# EAGLE design LM317_regulator (EAGLE 9.6.2)
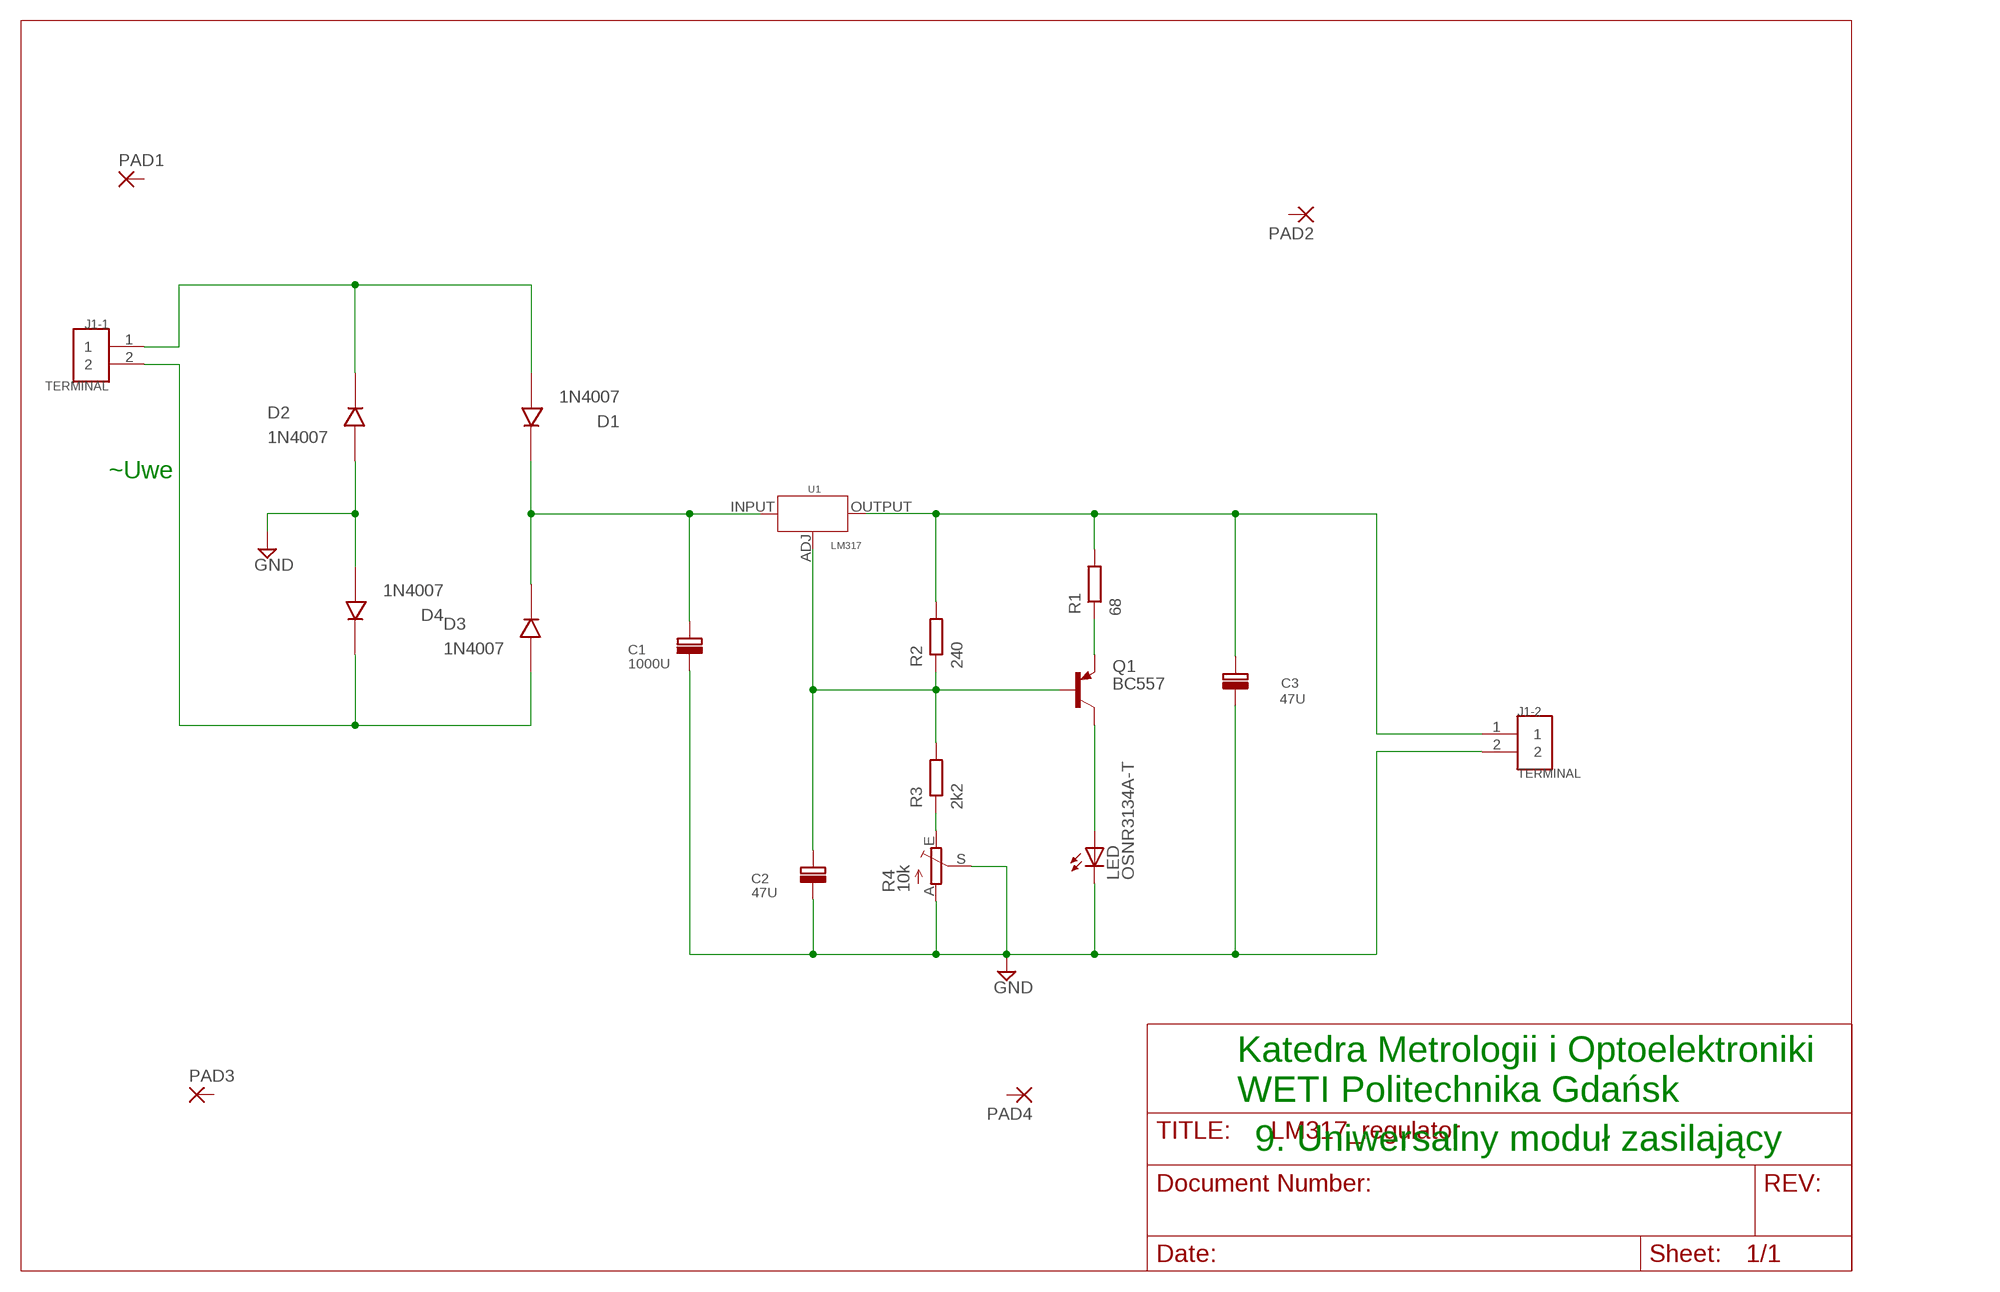
[diagram p0: schematic, sheet 1]

## Parts
C1  1000U  [1000U]
C2  47U  [47U]
C3  47U  [47U]
D1  1N4007  [1N4007]
D2  1N4007  [1N4007]
D3  1N4007  [1N4007]
D4  1N4007  [1N4007]
J1-1  TERMINAL  [TERMINAL]
J1-2  TERMINAL  [TERMINAL]
LED  OSNR3134A-T  LED3MM  [LED3MM]
PAD1  2,54/1,1  [2,54/1,1]
PAD2  2,54/1,1  [2,54/1,1]
PAD3  2,54/1,1  [2,54/1,1]
PAD4  2,54/1,1  [2,54/1,1]
Q1  BC557  [TO92-EBC]
R1  68  1206  [1206]
R2  240  1206  [1206]
R3  2k2  1206  [1206]
R4  10k  TRIM_EU-CA6V  [CA6V]
U1  LM317  [LM317]

## Nets
GND: C1.L C2.L C3.L D2.A(L) D4.A(L) J1-2.2 LED.K(C) R4.A R4.S
N$1: R3.1(H) R4.E
N$2: C1.H D1.C(H) D3.C(H) U1.INPUT(IN)
N$3: D3.A(L) D4.C(H) J1-1.2
N$4: D1.A(L) D2.C(H) J1-1.1
N$5: C2.H Q1.B R2.1(H) R3.2(L) U1.ADJ
N$6: Q1.E R1.1(H)
N$7: C3.H J1-2.1 R1.2(L) R2.2(L) U1.OUTPUT(OUT)
N$8: LED.A Q1.C
Unconnected: PAD1.1(P) PAD2.1(P) PAD3.1(P) PAD4.1(P)

## Notes on the sheet
- ~Uwe
- Katedra Metrologii i Optoelektroniki
  WETI Politechnika Gdańsk
- 9. Uniwersalny moduł zasilający

## Library data of the parts
C1 = Thoene:1000U
C2 C3 = Thoene:47U
D1-D4 = Thoene:1N4007
J1-1 J1-2 = Thoene:TERMINAL
LED = led:LED: LED OSRAM: - CHIPLED LG R971, LG N971, LY N971, LG Q971, LY Q971, LO R971, LY R971 LH N974, LH R974 LS Q976, LO Q976, LY Q976 LO Q996 - Hyper CHIPLED LW Q18S LB Q993, LB Q99A, LB R99A - SideLED LS A670, LO A670, LY A670, LG A670, LP A670 LB A673, LV A673, LT A673, LW A673 LH A674 LY A675 LS A676, LA A676, LO A676, LY A676, LW A676 LS A679, LY A679, LG A679 - Hyper Micro SIDELED® LS Y876, LA Y876, LO Y876, LY Y876 LT Y87S - SmartLED LW L88C, LW L88S LB L89C, LB L89S, LG L890 LS L89K, LO L89K, LY L89K LS L896, LA L896, LO L896, LY L896 - TOPLED LS T670, LO T670, LY T670, LG T670, LP T670 LSG T670, LSP T670, LSY T670, LOP T670, LYG T670 LG T671, LOG T671, LSG T671 LB T673, LV T673, LT T673, LW T673 LH T674 LS T676, LA T676, LO T676, LY T676, LB T676, LH T676, LSB T676, LW T676 LB T67C, LV T67C, LT T67C, LS T67K, LO T67K, LY T67K, LW E67C LS E67B, LA E67B, LO E67B, LY E67B, LB E67C, LV E67C, LT E67C LW T67C LS T679, LY T679, LG T679 LS T770, LO T770, LY T770, LG T770, LP T770 LB T773, LV T773, LT T773, LW T773 LH T774 LS E675, LA E675, LY E675, LS T675 LS T776, LA T776, LO T776, LY T776, LB T776 LHGB T686 LT T68C, LB T68C - Hyper Mini TOPLED® LB M676 - Mini TOPLED Santana® LG M470 LS M47K, LO M47K, LY M47K Source: http://www.osram.convergy.de LUXEON: - LUMILED® LXK2-PW12-R00, LXK2-PW12-S00, LXK2-PW14-U00, LXK2-PW14-V00 LXK2-PM12-R00, LXK2-PM12-S00, LXK2-PM14-U00 LXK2-PE12-Q00, LXK2-PE12-R00, LXK2-PE12-S00, LXK2-PE14-T00, LXK2-PE14-U00 LXK2-PB12-K00, LXK2-PB12-L00, LXK2-PB12-M00, LXK2-PB14-N00, LXK2-PB14-P00, LXK2-PB14-Q00 LXK2-PR12-L00, LXK2-PR12-M00, LXK2-PR14-Q00, LXK2-PR14-R00 LXK2-PD12-Q00, LXK2-PD12-R00, LXK2-PD12-S00 LXK2-PH12-R00, LXK2-PH12-S00 LXK2-PL12-P00, LXK2-PL12-Q00, LXK2-PL12-R00 Source: www.luxeon.com KINGBRIGHT: KA-3528ASYC Source: www.kingbright.com
PAD1-PAD4 = wirepad:2,54/1,1: THROUGH-HOLE PAD
Q1 = transistor-pnp:BC557*: PNP Transistror
R1-R3 = Thoene:1206
R4 = pot:TRIM_EU-: POTENTIOMETER
U1 = Thoene:LM317

## Board
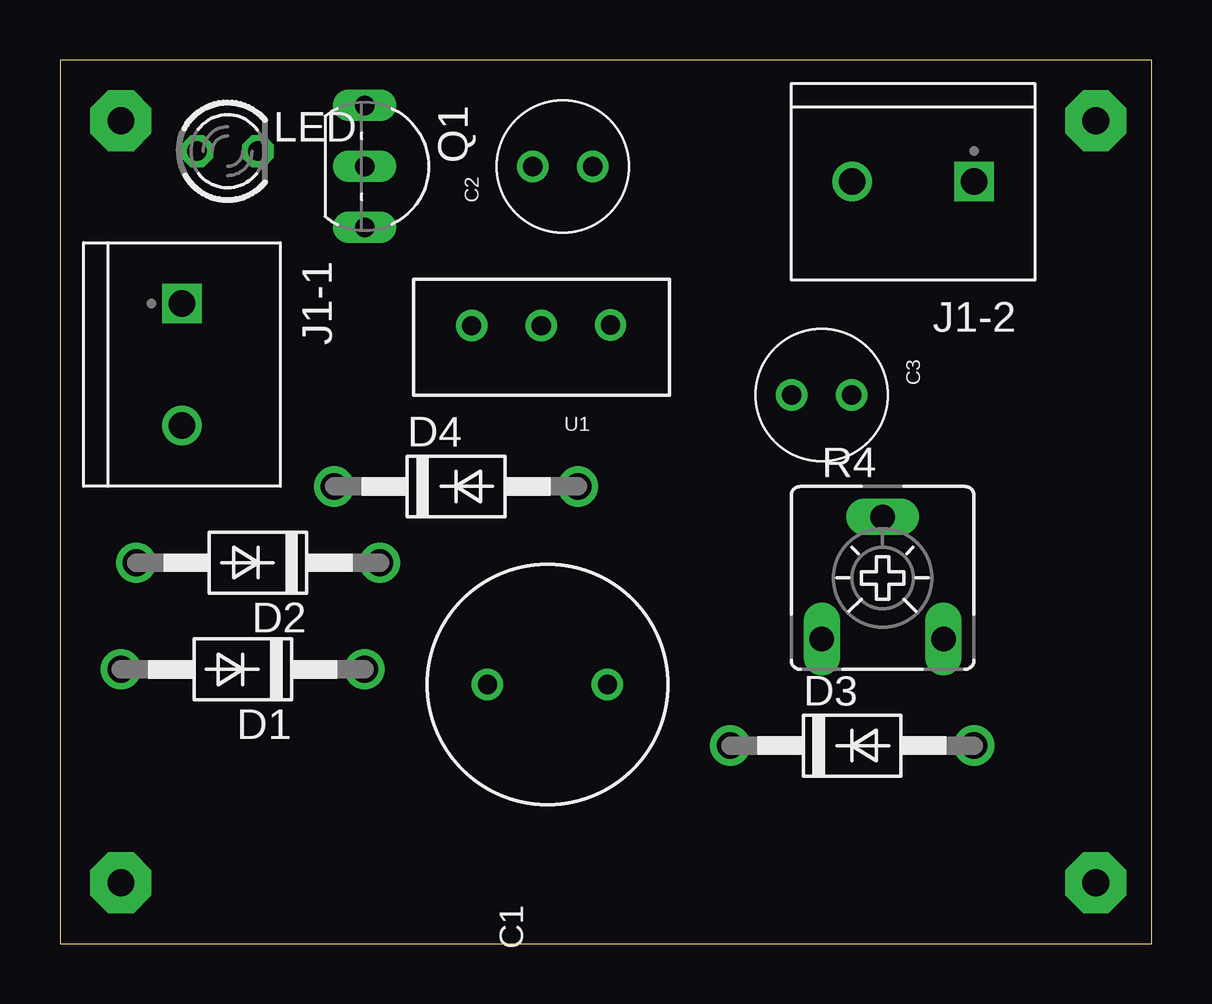
[diagram p1: board, top side]
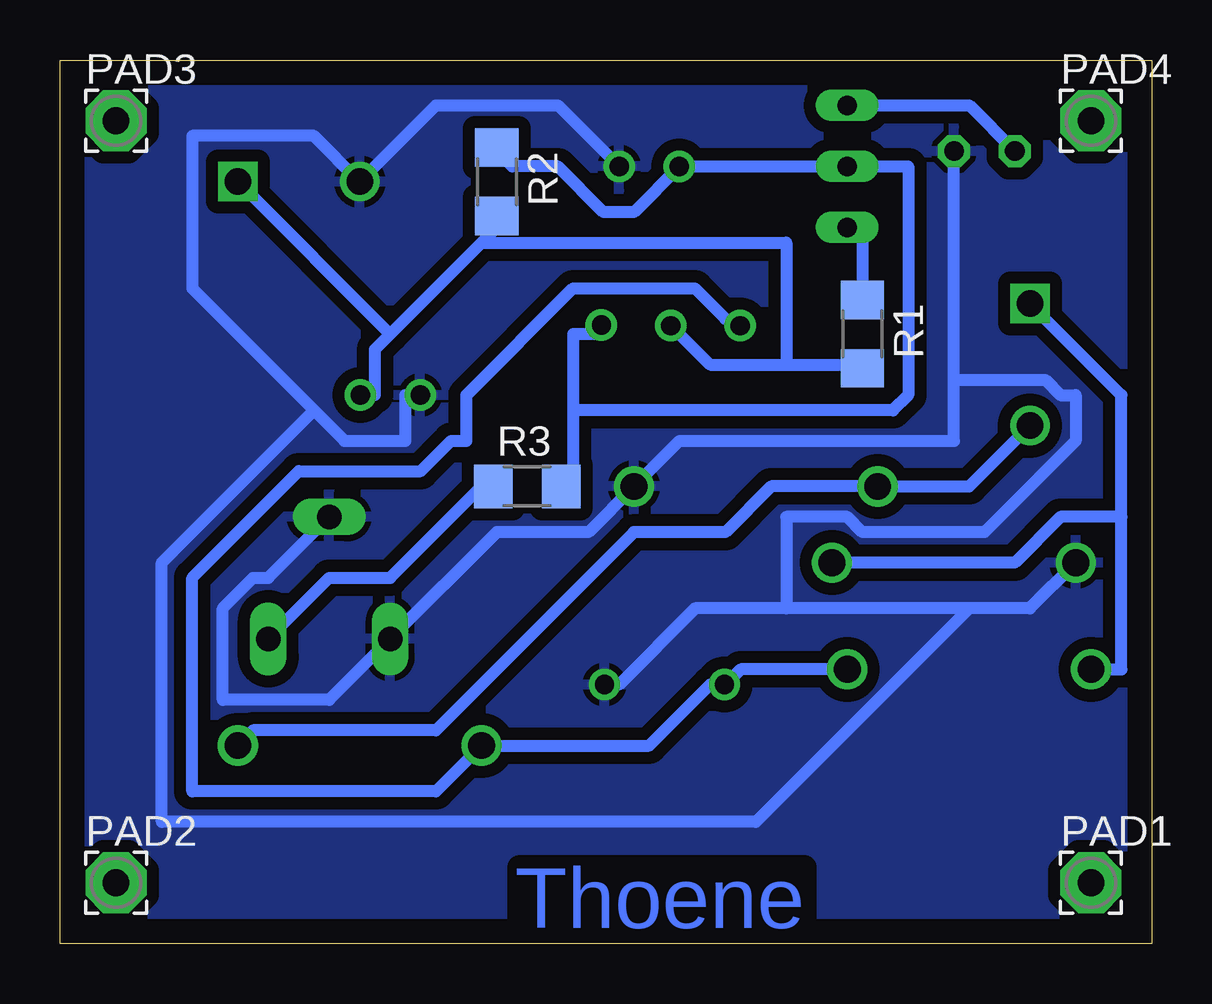
[diagram p2: board, bottom side, seen from below]

Size 45.52 x 36.82 mm. Coordinates in mm from the lower left corner, seen from the top.
Outline: 0,0 45.52,0 45.52,36.82 0,36.82 0,0
Copper layers (1*16): Top 0.035mm / dielectric 1.5mm / Bottom 0.035mm
Design rules "default *": minimum track width 15mil, minimum drill 24mil, track to track 20mil, track to pad 20mil, pad to pad 20mil, via to via 20mil, smd to smd 8mil, copper to edge 40mil, drill to drill 8mil, minimum pad ring 10mil, minimum via ring 8mil, stop-mask expansion 4mil, vias tented up to drill 0mil, thermal gap 10mil

### Footprints (pad centres in the part's own frame; a part is rotated, then mirrored left to right if it is on the bottom)
1000U = drill 0.8: H 0,2.5; L 0,-2.5
47U = drill 0.8: H 0,1.25; L 0,-1.25
1N4007 = drill 1.118: A 5.08,0; C -5.08,0
TERMINAL = drill 1.1 square: 1 -2.54,0 | drill 1.1: 2 2.54,0
LED3MM = drill 0.813 octagon: A -1.27,0; K 1.27,0
2,54/1,1 = drill 1.118 pad 2.54 octagon: 1 0,0
TO92-EBC = drill 0.813 long: B 0,-1.27; C -2.54,-1.27; E 2.54,-1.27
1206 = smd 1.6 x 1.803: 1 -1.422,0; 2 1.422,0
CA6V = drill 1.016 long: A -2.54,-2.54; E 2.54,-2.54; S 0,2.54
LM317 = drill 0.8: ADJ 2.45,-2.92; INPUT 8.24,-2.89; OUTPUT 5.34,-2.89

### Placement (x,y rotation side)
C1  20.32,10.8 90 top
C2  20.95,32.38 90 top
C3  31.75,22.86 270 top
D1  7.62,11.43 180 top
D2  8.26,15.88 180 top
D3  33.02,8.26 0 top
D4  16.51,19.05 0 top
J1-1  5.08,24.13 270 top
J1-2  35.56,31.75 180 top
LED  6.99,33.02 0 top
PAD1  2.54,2.54 0 bottom
PAD2  43.18,2.54 0 bottom
PAD3  43.18,34.29 0 bottom
PAD4  2.54,34.29 0 bottom
Q1  13.97,32.38 270 top
R1  12.06,25.4 270 bottom
R2  27.3,31.75 270 bottom
R3  26.04,19.05 0 bottom
R4  34.29,15.24 0 top
U1  25.4,22.86 180 top

### Tracks (layer width: path | path; a pad name or v marks a point on that pad's centre or on a via)
GND
  Bottom 0.508: 34.92,22.23 40.01,27.3 40.01,33.65 34.92,33.65 J1-2.2 29.84,34.93 24.77,34.93 22.23,32.38 C2.L | 34.92,22.23 33.66,20.96 31.11,20.96 31.11,22.86 C3.L | 7.62,13.97 5.08,13.97 D2.A | 7.62,13.97 15.24,13.97 | 15.24,13.97 19.05,13.97 22.23,10.8 C1.L | 8.26,23.49 8.26,20.96 19.68,20.96 D4.A 23.5,17.15 27.3,17.15 R4.A 34.29,10.16 38.73,10.16 38.73,13.97 37.47,15.24 36.83,15.24 R4.S | 8.26,23.49 LED.K | 15.24,13.97 15.24,17.78 12.7,17.78 12.06,17.15 6.99,17.15 3.17,20.96 3.17,22.86 3.81,22.86 4.45,23.49 8.26,23.49 | 34.92,22.23 41.27,15.88 41.27,5.08 16.51,5.08 7.62,13.97
  pour Bottom (isolate 0.127): 0,36.83 0,0 45.72,0 45.72,36.83
N$1
  Bottom 0.508: R4.E 34.29,15.24 31.75,15.24 27.94,19.05 R3.1
N$2
  Bottom 0.508: D1.C 17.14,11.43 17.78,10.8 C1.H 18.41,10.8 20.95,8.26 D3.C 29.84,6.35 40.01,6.35 40.01,15.24 35.56,19.69 30.48,19.69 29.21,20.96 28.57,20.96 28.57,22.86 24.13,27.3 19.05,27.3 17.78,26.04 U1.INPUT
N$3
  Bottom 0.508: J1-1.2 7.62,19.05 D4.C 15.88,19.05 17.78,17.15 21.59,17.15 29.84,8.89 37.47,8.89 D3.A
N$4
  Bottom 0.508: J1-1.1 1.27,22.86 1.27,17.78 | 1.27,17.78 1.27,11.43 D1.A | D2.C 5.71,15.88 3.81,17.78 1.27,17.78
N$5
  Bottom 0.508: 24.13,22.23 24.13,25.4 22.86,25.4 U1.ADJ | 24.13,22.23 24.13,19.05 R3.2 | 19.68,32.38 21.59,30.48 22.86,30.48 24.77,32.38 26.67,32.38 27.3,33.02 R2.1 | 19.68,32.38 Q1.B 10.16,32.38 10.16,22.86 10.79,22.23 24.13,22.23 | 19.68,32.38 C2.H
N$6
  Bottom 0.508: R1.1 12.06,29.85 Q1.E
N$7
  Bottom 0.508: 15.24,24.13 18.41,24.13 19.68,25.4 U1.OUTPUT | 15.24,24.13 12.06,24.13 R1.2 | 31.75,25.4 32.38,24.76 32.38,22.86 C3.H | 31.75,25.4 27.94,29.21 | 27.94,29.21 27.3,29.85 R2.2 | 31.75,25.4 J1-2.1 | 15.24,24.13 15.24,29.21 27.94,29.21
N$8
  Bottom 0.508: LED.A 7.62,34.93 Q1.C

### Text on the board
Bottom: Thoene